# EasyEDA schematic schematics.json
TITLE: Sheet_1; REV: 1.0; Date: 2020-03-21; Sheet: 1/1; Drawn By: samibenali.electrical; Company: Your Company
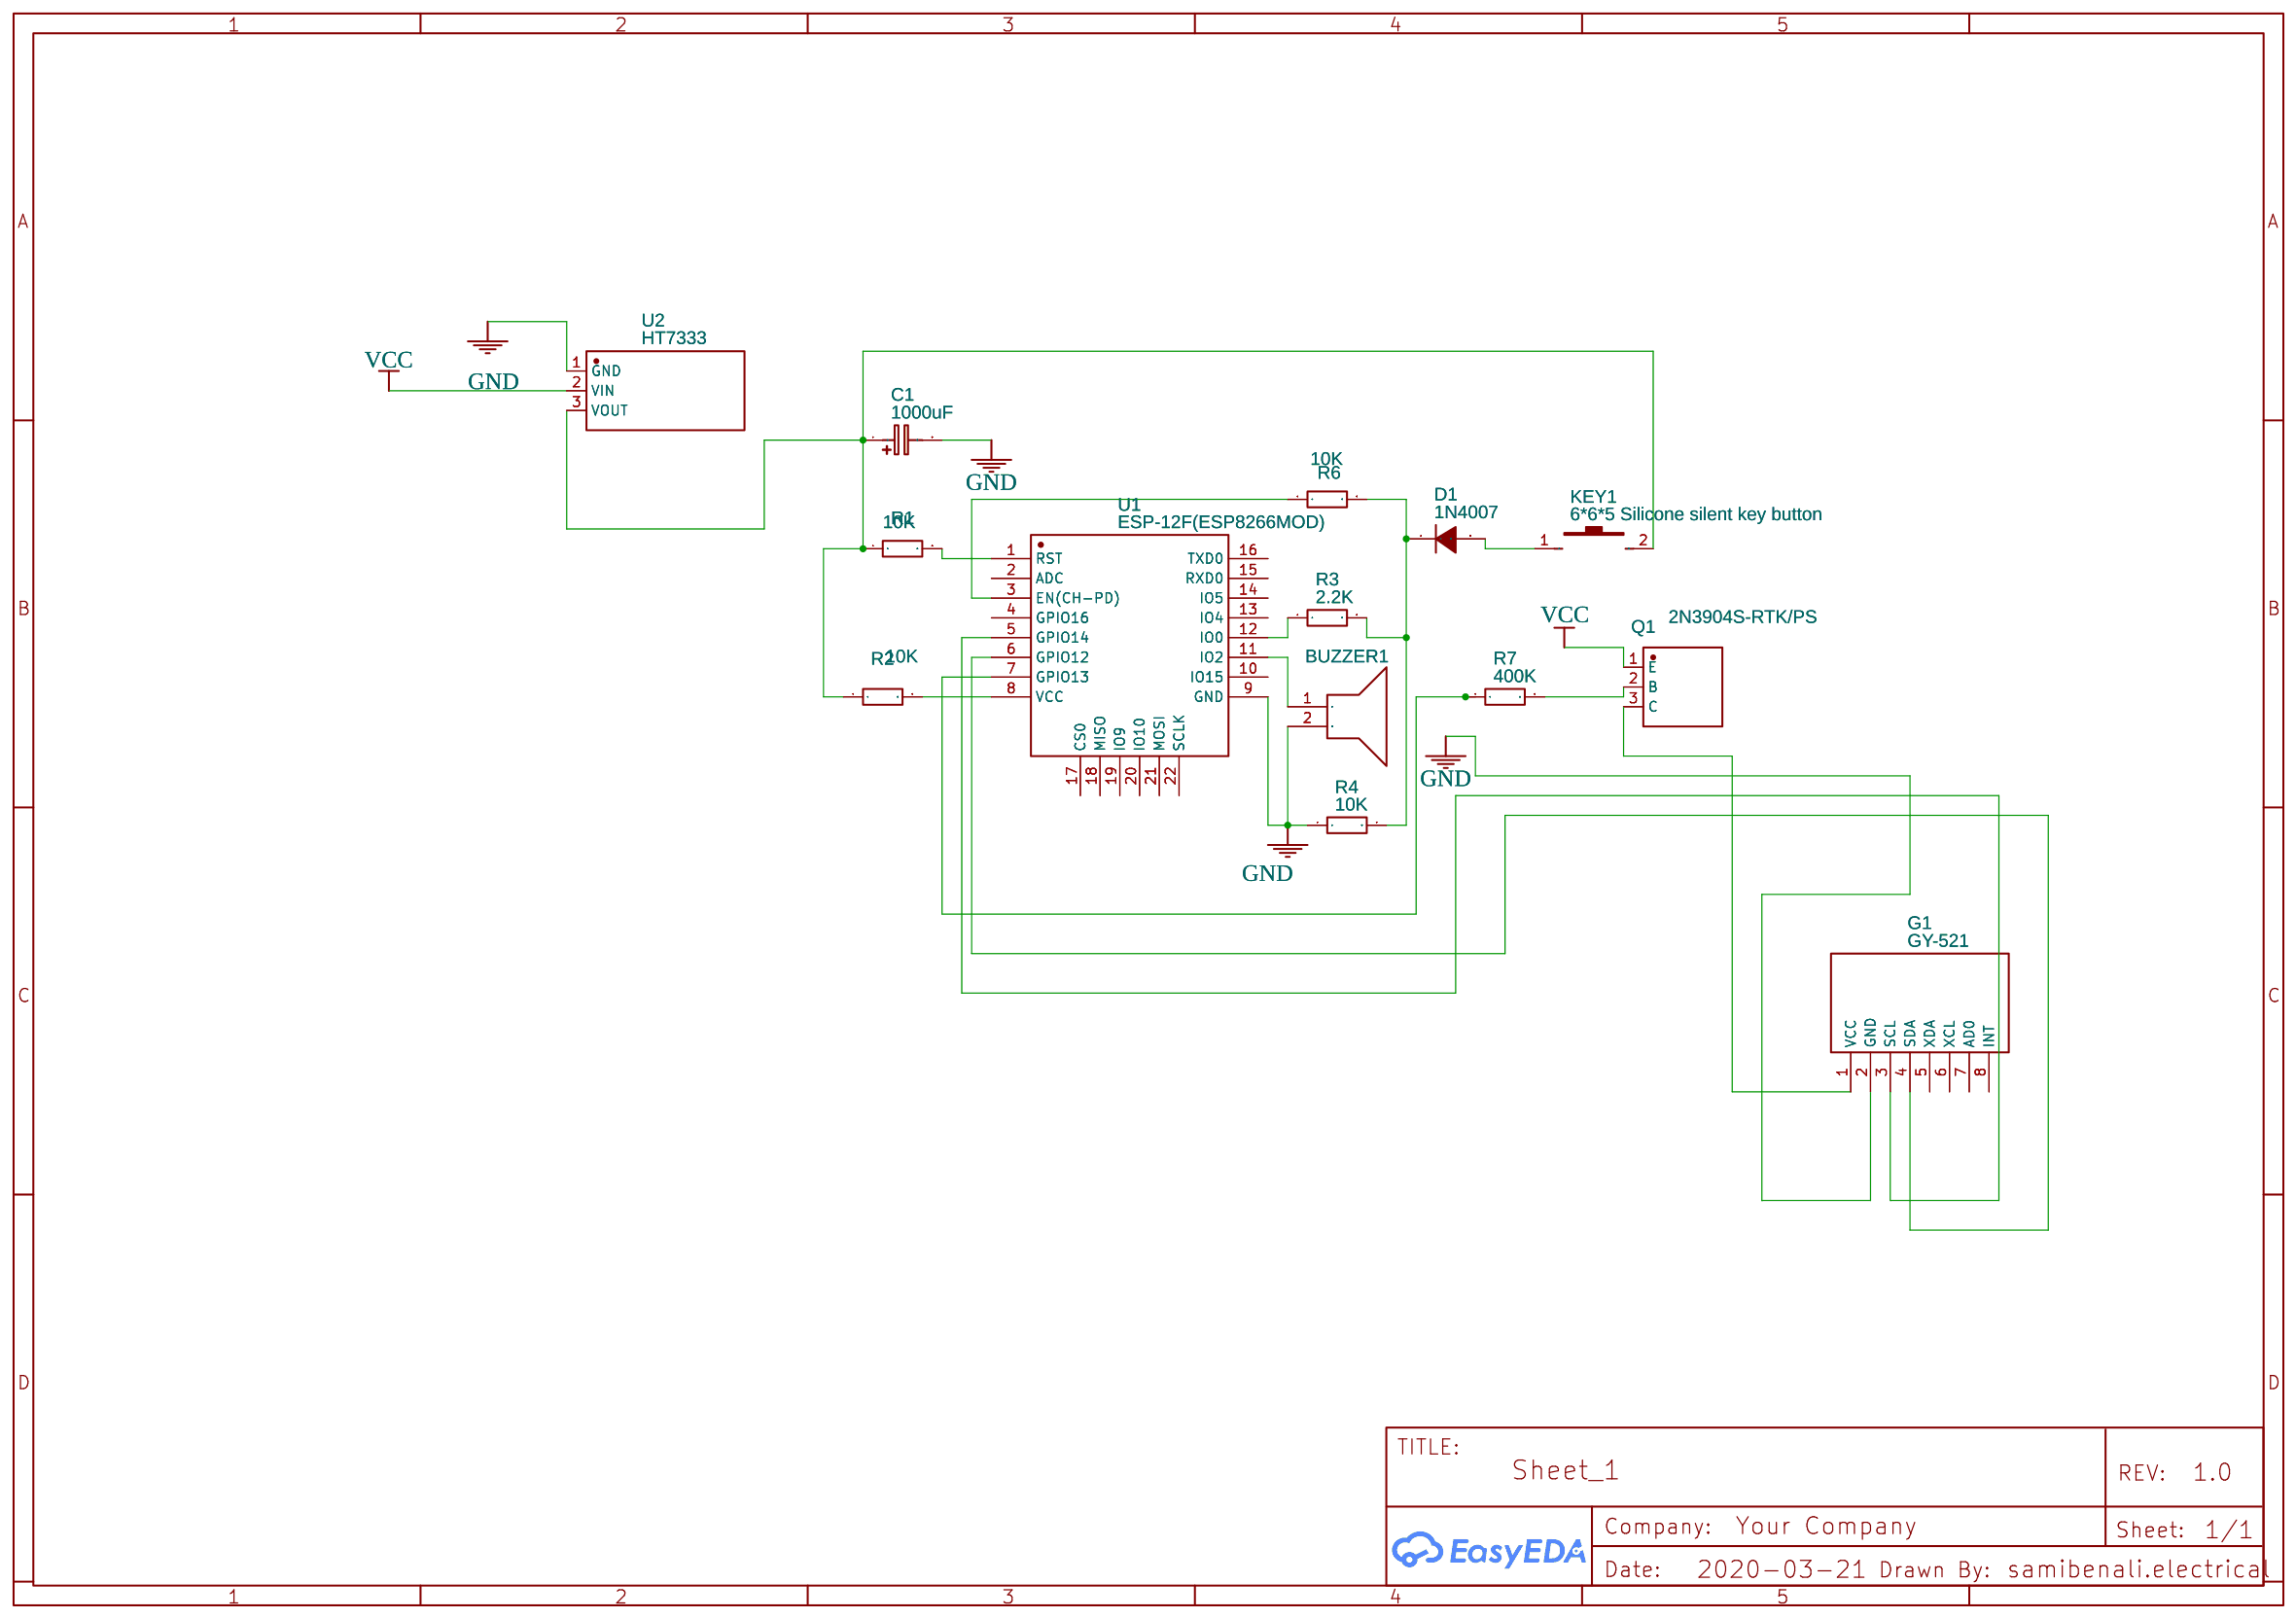
[diagram p0: schematic sheet]

## Parts
#1  -
BUZZER1  GPC1708AT-5V4000  [BUZ-TH_BD17.0-P10.00-D0.9]
C1  1000uF  [CAP-SMD_L7.3-W4.3-L-FD]
D1  1N4007  [DO-41_BD2.4-L4.7-P8.70-D0.9-RD]
G1  GY-521  [GY-521]
KEY1  6*6*5 Silicone silent key button  [KEY-SMD_L6.0-W6.0-LS6.6_C61120]
Q1  2N3904S-RTK/PS  [SOT-23-3_L2.9-W1.3-P1.90-LS2.4-BR]
R1  10K  [R0603]
R2  10K  [R0603]
R3  2.2K  [R0603]
R4  10K  [R0603]
R6  10K  [R0603]
R7  400K  [R0603]
U1  ESP-12F(ESP8266MOD)  [WIFIM-SMD_ESP-12F-ESP8266MOD]
U2  HT7333  [SOT-89(SOT-89-3)]

## Library data of the parts
#1 = -: BOM_Manufacturer Part: ?
BUZZER1 = GPC1708AT-5V4000: Supplier: LCSC; Supplier Part: C252954; Manufacturer: INGHAi; Contributor: LCSC
C1 = 2R5TPE1000MF: Supplier: LCSC; Supplier Part: C347550; Manufacturer: PANASONIC; Contributor: LCSC; LCSC Assembly: Yes; SMT Type: Extend
D1 = 1N4007: Supplier: LCSC; Manufacturer: SEMTECH; Supplier Part: C106903
G1 = GY-521: Supplier: FL; link: Beschleunigungssensor Breakout; Contributor: aufuh
KEY1 = 6*6*5 Silicone silent key button: Supplier Part: C61120; Supplier: LCSC; Manufacturer: ReliaPro
Q1 = 2N3904S-RTK/PS: Supplier: LCSC; Supplier Part: C112667; Manufacturer: KEC Semicon; Contributor: LCSC
R1 R2 R4 R6 = 060300J0103T5E: Supplier: LCSC; Manufacturer: UniOhm; Contributor: LCSC; Supplier Part: C149496
R3 = 060300F2201T5E: Supplier: LCSC; Manufacturer: UniOhm; Contributor: LCSC; Supplier Part: C145170
R7 = 060300J0224T5E: Supplier: LCSC; Manufacturer: UniOhm; Contributor: LCSC; Supplier Part: C146166
U1 = ESP-12F(ESP8266MOD): Supplier: LCSC; Manufacturer: Ai-Thinker; Supplier Part: C82891
U2 = HT7333: Supplier: LCSC; Supplier Part: C259241; Manufacturer: Holtek Semicon; Contributor: LCSC

## Nets
GND: BUZZER1.2 C1.2 G1.2(GND) R4.1 U1.9(GND) U2.1(GND)
VCC: Q1.1(E) U2.2(VIN)
Net-(BUZZER1-1): BUZZER1.1 U1.11(IO2)
Net-(C1-1): C1.1 KEY1.2 R1.1 R2.1 U2.3(VOUT)
Net-(D1-1): D1.1(K) R3.2 R4.2 R6.2
Net-(D1-2): D1.2(A) KEY1.1
Net-(G1-1): G1.1(VCC) Q1.3(C)
Net-(G1-3): G1.3(SCL) U1.5(GPIO14)
Net-(G1-4): G1.4(SDA) U1.6(GPIO12)
Net-(Q1-2): Q1.2(B) R7.2
Net-(R1-2): R1.2 U1.1(RST)
Net-(R2-2): R2.2 U1.8(VCC)
Net-(R3-1): R3.1 U1.12(IO0)
Net-(R6-1): R6.1 U1.3(EN(CH-PD))
Net-(R7-1): R7.1 U1.7(GPIO13)

Not connected (* = marked no-connect by the designer): G1 5(XDA) 6(XCL) 7(AD0) 8(INT); U1 2(ADC) 4(GPIO16) 10(IO15) 13(IO4) 14(IO5) 15(RXD0) 16(TXD0) 17(CS0) 18(MISO) 19(IO9) 20(IO10) 21(MOSI) 22(SCLK)
